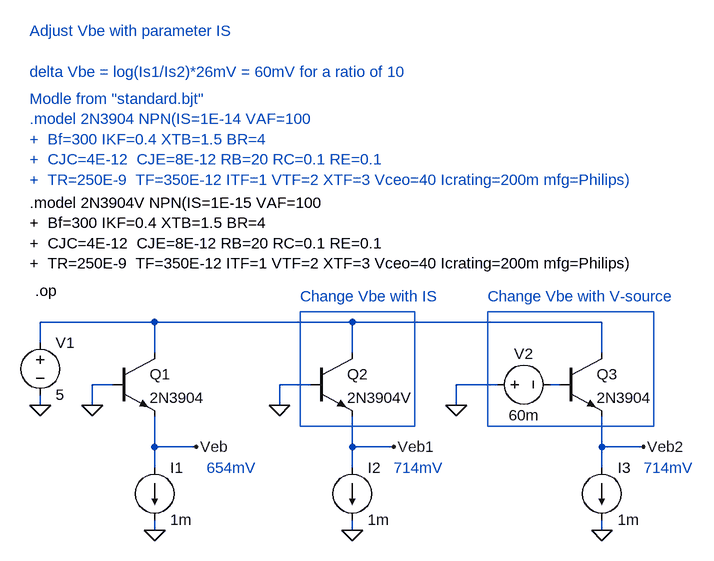
[diagram p0: schematic Adjust_vbe.asc]
Adjust_vbe.asc, the LTspice schematic file:
Version 4
SHEET 1 1068 680
WIRE 208 -16 32 -16
WIRE 512 -16 208 -16
WIRE 896 -16 512 -16
WIRE 32 16 32 -16
WIRE 208 32 208 -16
WIRE 512 32 512 -16
WIRE 896 32 896 -16
WIRE 144 80 112 80
WIRE 448 80 400 80
WIRE 736 80 672 80
WIRE 832 80 816 80
WIRE 32 112 32 96
WIRE 112 112 112 80
WIRE 400 112 400 80
WIRE 672 112 672 80
WIRE 208 176 208 128
WIRE 272 176 208 176
WIRE 512 176 512 128
WIRE 576 176 512 176
WIRE 896 176 896 128
WIRE 960 176 896 176
WIRE 208 208 208 176
WIRE 512 208 512 176
WIRE 896 208 896 176
WIRE 208 304 208 288
WIRE 512 304 512 288
WIRE 896 304 896 288
FLAG 208 304 0
FLAG 112 112 0
FLAG 32 112 0
FLAG 272 176 Veb
FLAG 512 304 0
FLAG 400 112 0
FLAG 576 176 Veb1
FLAG 896 304 0
FLAG 672 112 0
FLAG 960 176 Veb2
SYMBOL npn 144 32 R0
SYMATTR InstName Q1
SYMATTR Value 2N3904
SYMBOL current 208 208 R0
SYMATTR InstName I1
SYMATTR Value 1m
SYMBOL voltage 32 0 R0
SYMATTR InstName V1
SYMATTR Value 5
SYMBOL npn 448 32 R0
SYMATTR InstName Q2
SYMATTR Value 2N3904V
SYMBOL current 512 208 R0
SYMATTR InstName I2
SYMATTR Value 1m
SYMBOL npn 832 32 R0
SYMATTR InstName Q3
SYMATTR Value 2N3904
SYMBOL current 896 208 R0
SYMATTR InstName I3
SYMATTR Value 1m
SYMBOL voltage 720 80 R270
WINDOW 0 32 56 VTop 0
WINDOW 3 -32 56 VBottom 0
SYMATTR InstName V2
SYMATTR Value 60m
TEXT 16 -200 Left 0 !.model 2N3904V NPN(IS=1E-15 VAF=100\n+  Bf=300 IKF=0.4 XTB=1.5 BR=4\n+  CJC=4E-12  CJE=8E-12 RB=20 RC=0.1 RE=0.1\n+  TR=250E-9  TF=350E-12 ITF=1 VTF=2 XTF=3 Vceo=40 Icrating=200m mfg=Philips)
TEXT 16 -360 Left 0 ;Modle from "standard.bjt"\n.model 2N3904 NPN(IS=1E-14 VAF=100\n+  Bf=300 IKF=0.4 XTB=1.5 BR=4\n+  CJC=4E-12  CJE=8E-12 RB=20 RC=0.1 RE=0.1\n+  TR=250E-9  TF=350E-12 ITF=1 VTF=2 XTF=3 Vceo=40 Icrating=200m mfg=Philips)
TEXT 24 -64 Left 0 !.op
TEXT 288 208 Left 0 ;654mV
TEXT 576 208 Left 0 ;714mV
TEXT 960 208 Left 0 ;714mV
TEXT 16 -464 Left 0 ;Adjust Vbe with parameter IS\n \ndelta Vbe = log(Is1/Is2)*26mV = 60mV for a ratio of 10
TEXT 432 -56 Left 0 ;Change Vbe with IS
TEXT 720 -56 Left 0 ;Change Vbe with V-source
RECTANGLE Normal 976 144 720 -32
RECTANGLE Normal 608 144 432 -32

The netlist it stands for:
* Adjust_vbe.asc
Q1 N001 0 Veb 0 2N3904
I1 Veb 0 1m
V1 N001 0 5
Q2 N001 0 Veb1 0 2N3904V
I2 Veb1 0 1m
Q3 N001 N002 Veb2 0 2N3904
I3 Veb2 0 1m
V2 0 N002 60m
.model NPN NPN
.model PNP PNP
.lib standard.bjt
.model 2N3904V NPN(IS=1E-15 VAF=100
+  Bf=300 IKF=0.4 XTB=1.5 BR=4
+  CJC=4E-12  CJE=8E-12 RB=20 RC=0.1 RE=0.1
+  TR=250E-9  TF=350E-12 ITF=1 VTF=2 XTF=3 Vceo=40 Icrating=200m mfg=Philips)
* Modle from "standard.bjt"
* .model 2N3904 NPN(IS=1E-14 VAF=100
* +  Bf=300 IKF=0.4 XTB=1.5 BR=4
* +  CJC=4E-12  CJE=8E-12 RB=20 RC=0.1 RE=0.1
* +  TR=250E-9  TF=350E-12 ITF=1 VTF=2 XTF=3 Vceo=40 Icrating=200m mfg=Philips)
.op
* 654mV
* 714mV
* 714mV
* Adjust Vbe with parameter IS
* delta Vbe = log(Is1/Is2)*26mV = 60mV for a ratio of 10
* Change Vbe with IS
* Change Vbe with V-source
.backanno
.end